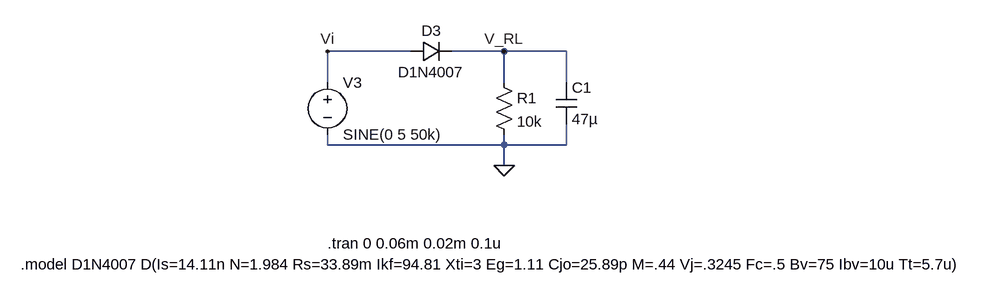
[diagram p0: schematic F2.asc]
F2.asc, the LTspice schematic file:
Version 4
SHEET 1 1572 680
WIRE 496 48 368 48
WIRE 640 48 560 48
WIRE 736 48 640 48
WIRE 368 96 368 48
WIRE 640 96 640 48
WIRE 736 96 736 48
WIRE 368 192 368 176
WIRE 640 192 640 176
WIRE 640 192 368 192
WIRE 736 192 736 160
WIRE 736 192 640 192
WIRE 640 224 640 192
FLAG 640 224 0
FLAG 640 48 V_RL
FLAG 368 48 Vi
SYMBOL voltage 368 80 R0
WINDOW 123 0 0 Left 2
WINDOW 39 0 0 Left 2
SYMATTR InstName V3
SYMATTR Value SINE(0 5 50k)
SYMBOL diode 496 64 R270
WINDOW 0 32 32 VTop 2
WINDOW 3 0 32 VBottom 2
SYMATTR InstName D3
SYMATTR Value D1N4007
SYMBOL res 624 80 R0
SYMATTR InstName R1
SYMATTR Value 10k
SYMBOL cap 720 96 R0
SYMATTR InstName C1
SYMATTR Value 47µ
TEXT 368 344 Left 2 !.tran 0 0.06m 0.02m 0.1u
TEXT -104 376 Left 2 !.model D1N4007 D(Is=14.11n N=1.984 Rs=33.89m Ikf=94.81 Xti=3 Eg=1.11 Cjo=25.89p M=.44 Vj=.3245 Fc=.5 Bv=75 Ibv=10u Tt=5.7u)

The netlist it stands for:
* F2.asc
V3 Vi 0 SINE(0 5 50k)
D3 Vi V_RL D1N4007
R1 V_RL 0 10k
C1 V_RL 0 47µ
.model D D
.lib standard.dio
.tran 0 0.06m 0.02m 0.1u
.model D1N4007 D(Is=14.11n N=1.984 Rs=33.89m Ikf=94.81 Xti=3 Eg=1.11 Cjo=25.89p M=.44 Vj=.3245 Fc=.5 Bv=75 Ibv=10u Tt=5.7u)
.backanno
.end